# EAGLE design binaryspacebadgev1 (EAGLE 7.3.0)
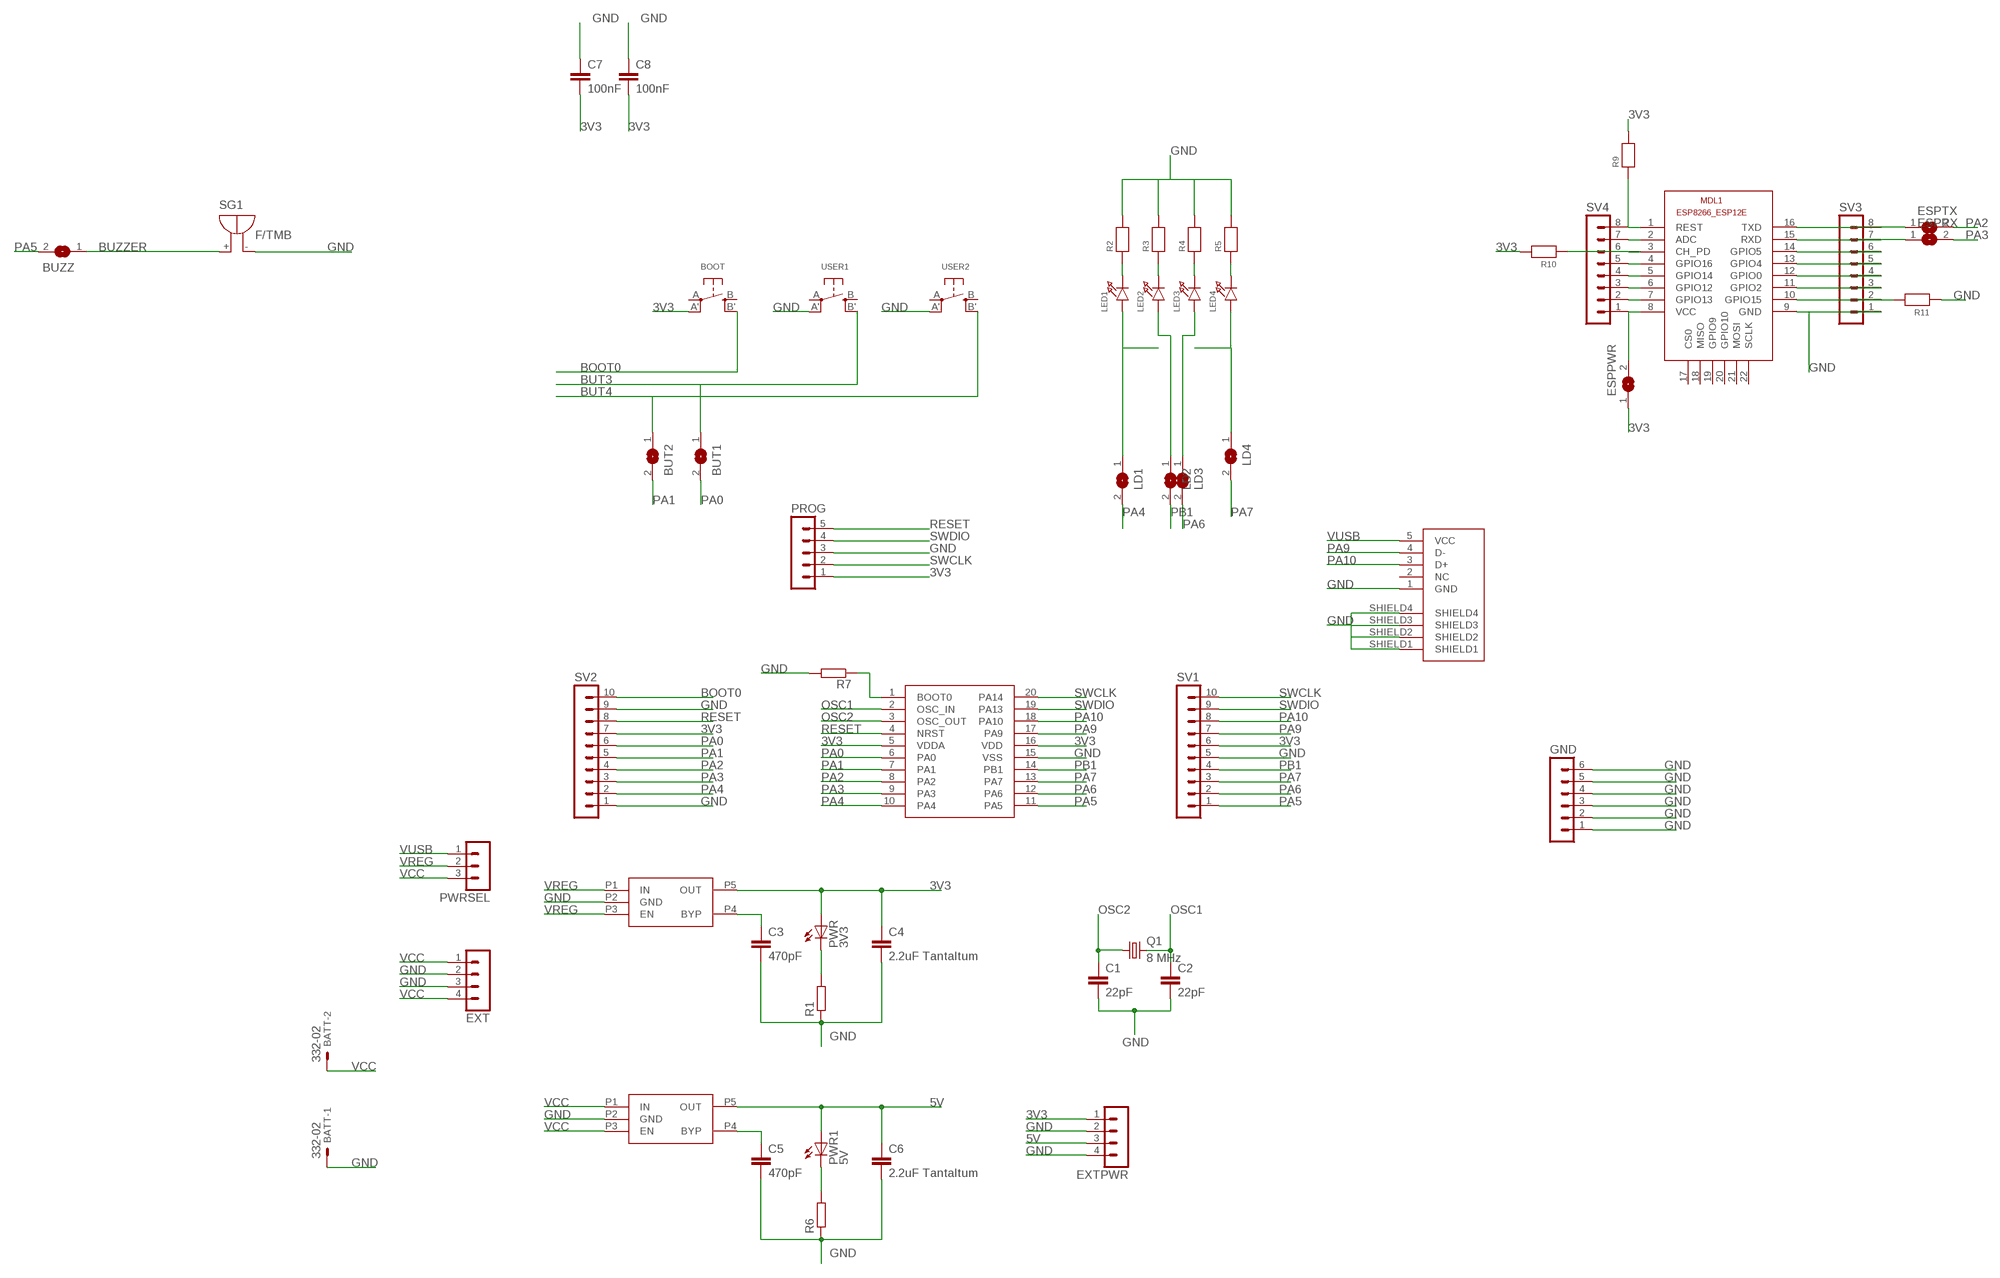
[diagram p0: schematic, sheet 1]

## Parts
BATT  332-02  [332-02]
BOOT  SWITCH_TACT_SMT  [EVQ-Q2]
BUT1  SOLDERJUMPER  [SOLDERJUMPER_ARROW_NOPASTE]
BUT2  SOLDERJUMPER  [SOLDERJUMPER_ARROW_NOPASTE]
BUZZ  SOLDERJUMPER  [SOLDERJUMPER_ARROW_NOPASTE]
C1  22pF  C-EUC0603  [C0603]
C2  22pF  C-EUC0603  [C0603]
C3  470pF  C-EUC0603  [C0603]
C4  2.2uF Tantaltum  C-EUC0805  [C0805]
C5  470pF  C-EUC0603  [C0603]
C6  2.2uF Tantaltum  C-EUC0805  [C0805]
C7  100nF  C-EUC0603  [C0603]
C8  100nF  C-EUC0603  [C0603]
ESPPWR  SOLDERJUMPER  [SOLDERJUMPER_ARROW_NOPASTE]
ESPRX  SOLDERJUMPER  [SOLDERJUMPER_ARROW_NOPASTE]
ESPTX  SOLDERJUMPER  [SOLDERJUMPER_ARROW_NOPASTE]
EXT  MA04-1  [MA04-1]
EXTPWR  MA04-1  [MA04-1]
GND  MA06-1  [MA06-1]
LD1  SOLDERJUMPER  [SOLDERJUMPER_ARROW_NOPASTE]
LD2  SOLDERJUMPER  [SOLDERJUMPER_ARROW_NOPASTE]
LD3  SOLDERJUMPER  [SOLDERJUMPER_ARROW_NOPASTE]
LD4  SOLDERJUMPER  [SOLDERJUMPER_ARROW_NOPASTE]
LED1  LED0805  [CHIPLED_0805]
LED2  LED0805  [CHIPLED_0805]
LED3  LED0805  [CHIPLED_0805]
LED4  LED0805  [CHIPLED_0805]
MDL1  ESP8266-12EESP8266-ESP12E  [ESP8266-ESP12E]
PROG  MA05-1  [MA05-1]
PWR  3V3  LEDSML0603  [SML0603]
PWR1  5V  LEDSML0603  [SML0603]
PWRSEL  MA03-1  [MA03-1]
Q1  8 MHz  CRYSTAL  [SM49]
R1  R-EU_R0603  [R0603]
R2  RESISTOR0603  [0603]
R3  RESISTOR0603  [0603]
R4  RESISTOR0603  [0603]
R5  RESISTOR0603  [0603]
R6  R-EU_R0603  [R0603]
R7  R-EU_R0603  [R0603]
R9  RESISTOR0603  [0603]
R10  RESISTOR0603  [0603]
R11  RESISTOR0603  [0603]
SG1  F/TMB  [F/TMB]
SV1  MA10-1  [MA10-1]
SV2  MA10-1  [MA10-1]
SV3  MA08-1  [MA08-1]
SV4  MA08-1  [MA08-1]
U$1  STM32F030X4792-5925  [TSSOP20]
U$2  MIC5219-X.XBM5MIC5219-3.3YM5TR  [SOT-23-5]
U$3  USBSOCK_MINI_SMD  [USBSOCK_MINI_SMD]
U$4  MIC5219-X.XBM5MIC5219-3.3YM5TR  [SOT-23-5]
USER1  SWITCH_TACT_SMT  [EVQ-Q2]
USER2  SWITCH_TACT_SMT  [EVQ-Q2]

## Nets
3V3: BOOT.A'(P1) C4.1 C7.2 C8.2 ESPPWR.1 EXTPWR.1 PROG.1 PWR.A R9.2 R10.2 SV1.6 SV2.7 U$1.5(VDDA) U$1.16(VDD) U$2.P5(OUT)
5V: C6.1 EXTPWR.3 PWR1.A U$4.P5(OUT)
BLAH: PWR1.C R6.2
BLAH2: PWR.C R1.2
BOOT0: BOOT.B'(S1) R7.1 SV2.10 U$1.1(BOOT0)
BUT3: BUT1.1 USER1.B'(S1)
BUT4: BUT2.1 USER2.B'(S1)
BUZZER: BUZZ.1 SG1.+
GND: BATT.1 C1.2 C2.2 C3.2 C4.2 C5.2 C6.2 C7.1 C8.1 EXT.2 EXT.3 EXTPWR.2 EXTPWR.4 GND.1 GND.2 GND.3 GND.4 GND.5 GND.6 MDL1.9(GND) PROG.3 R1.1 R2.2 R3.2 R4.2 R5.2 R6.1 R7.2 R11.1 SG1.- SV1.5 SV2.1 SV2.9 SV3.1 U$1.15(VSS) U$2.P2(GND) U$3.1(GND) U$3.SHIELD1 U$3.SHIELD2 U$3.SHIELD3 U$3.SHIELD4 U$4.P2(GND) USER1.A'(P1) USER2.A'(P1)
LED1: LD1.1 LED1.A
LED2: LD2.1 LED2.A
LED3: LD3.1 LED3.A
LED4: LD4.1 LED4.A
N$2: C3.1 U$2.P4(BYP)
N$3: C5.1 U$4.P4(BYP)
N$4: LED1.C R2.1
N$5: LED2.C R3.1
N$6: LED3.C R4.1
N$7: LED4.C R5.1
N$8: ESPTX.1 MDL1.16(TXD) SV3.8
N$9: ESPRX.1 MDL1.15(RXD) SV3.7
N$10: MDL1.14(GPIO5) SV3.6
N$11: MDL1.13(GPIO4) SV3.5
N$12: MDL1.12(GPIO0) SV3.4
N$13: MDL1.11(GPIO2) SV3.3
N$14: MDL1.10(GPIO15) R11.2 SV3.2
N$16: MDL1.1(REST) R9.1 SV4.8
N$17: MDL1.2(ADC) SV4.7
N$18: MDL1.3(CH_PD) R10.1 SV4.6
N$19: MDL1.4(GPIO16) SV4.5
N$20: MDL1.5(GPIO14) SV4.4
N$21: MDL1.6(GPIO12) SV4.3
N$22: MDL1.7(GPIO13) SV4.2
N$23: ESPPWR.2 MDL1.8(VCC) SV4.1
OSC1: C2.1 Q1.2 U$1.2(OSC_IN)
OSC2: C1.1 Q1.1 U$1.3(OSC_OUT)
PA0: BUT1.2 SV2.6 U$1.6(PA0)
PA1: BUT2.2 SV2.5 U$1.7(PA1)
PA2: ESPTX.2 SV2.4 U$1.8(PA2)
PA3: ESPRX.2 SV2.3 U$1.9(PA3)
PA4: LD1.2 SV2.2 U$1.10(PA4)
PA5: BUZZ.2 SV1.1 U$1.11(PA5)
PA6: LD3.2 SV1.2 U$1.12(PA6)
PA7: LD4.2 SV1.3 U$1.13(PA7)
PA9: SV1.7 U$1.17(PA9) U$3.4(D-)
PA10: SV1.8 U$1.18(PA10) U$3.3(D+)
PB1: LD2.2 SV1.4 U$1.14(PB1)
RESET: PROG.5 SV2.8 U$1.4(NRST)
SWCLK: PROG.2 SV1.10 U$1.20(PA14)
SWDIO: PROG.4 SV1.9 U$1.19(PA13)
VCC: BATT.2 EXT.1 EXT.4 PWRSEL.3 U$4.P1(IN) U$4.P3(EN)
VREG: PWRSEL.2 U$2.P1(IN) U$2.P3(EN)
VUSB: PWRSEL.1 U$3.5(VCC)
Unconnected: BOOT.A(P) BOOT.B(S) MDL1.17(CS0) MDL1.18(MISO) MDL1.19(GPIO9) MDL1.20(GPIO10) MDL1.21(MOSI) MDL1.22(SCLK) U$3.2(NC) USER1.A(P) USER1.B(S) USER2.A(P) USER2.B(S)

## Library data of the parts
BATT = con-garry:332-02: 2 Pin - 2mm Dual Row Source: www.mpe-connector.de / garry_shortform_2012.pdf
BOOT USER1 USER2 = microbuilder:SWITCH_TACT_SMT: SMT Tact Switches 6x6mm - Digikey: P12940SCT-ND KMR2 (4.6x2.8mm) - Digikey: 401-1426-1-ND EVQ-PQHB55 - Light Touch, 160GF (4.5x4.5mm) - Digikey: P8090SCT-ND
BUT1 BUT2 BUZZ ESPPWR ESPRX ESPTX LD1-LD4 = microbuilder:SOLDERJUMPER: SMD Solder JUMPER Solder the two pads together to create a connection, or remove the solder to break it. REFLOW - Use this footprint for solder paste and reflow ovens. WAVE - Use this footprint for hand-soldering (larger pads). CLOSED - Has a trace between the two pads to ensure it is closed by default. The trace needs to be cut to disable the jumper, and can be closed again by creating a solder bridge between the two pads.; BOM: EXCLUDE
C1-C8 = rcl:C-EU: CAPACITOR, European symbol
EXT EXTPWR = con-lstb:MA04-1: PIN HEADER; OC_FARNELL: unknown; OC_NEWARK: unknown
GND = con-lstb:MA06-1: PIN HEADER; OC_FARNELL: unknown; OC_NEWARK: unknown
LED1-LED4 = microbuilder:LED: LED
MDL1 = ESP8266-ESP12E:ESP8266-12E: ESP8266-12E with additional I/O and GPIO04/05 corrected The author cannot warrant that this library is free from error or will meet your specific requirements. Created by PuceBaboon.com. Komagane, Nagano, JAPAN
PROG = con-lstb:MA05-1: PIN HEADER; OC_FARNELL: unknown; OC_NEWARK: unknown
PWR PWR1 = led:LED: LED
PWRSEL = con-lstb:MA03-1: PIN HEADER; OC_FARNELL: unknown; OC_NEWARK: unknown
Q1 = protofactory:CRYSTAL: CRYSTAL
R1 R6 R7 = resistor:R-EU_: RESISTOR, European symbol
R2-R5 R9-R11 = microbuilder:RESISTOR: Resistors 0402 - 0402 Surface Mount Package 22 Ohm 1% 1/16W [Digikey: 311-22.0LRTR-ND] 33 Ohm 5% 1/16W 1.0K 5% 1/16W 1.5K 5% 1/16W 2.0K 1% 1/16W 10.0K 1% 1/16W [Digikey: 311-10.0KLRTR-ND] 10.0K 5% 1/16W [Digikey: RMCF0402JT10K0TR-ND] 12.1K 1% 1/16W [Digikey: 311-22.0LRTR-ND] 100.0K 5% 1/16W 0603 - 0603 Surface Mount Package 0 Ohm 1/10 Watt 1% Resistor 15 Ohm 1/10 Watt 1% Resistor 33 Ohm 1/10 Watt 1% Resistor 49.9 Ohm 1/10 Watt 1% Resistor 100 Ohm 1/10 Watt 1% Resistor 150 Ohm 1/10 Watt 1% Resistor 240 Ohm 1/10 Watt 1% Resistor 390 Ohm 1/10 Watt 1% Resistor 560 Ohm 1/10 Watt 1% Resistor 680 Ohm 1/10 Watt 1% Resistor 750 Ohm 1/10 Watt 1% Resistor 1.0K Ohm 1/10 Watt 1% Resistor 1.5K Ohm 1/10 Watt 1% Resistor 2.0K Ohm 1/10 Watt 1% Resistor 2.2K Ohm 1/10 Watt 1% Resistor 3.3K Ohm 1/10 Watt 1% Resistor 4.7K Ohm 1/10 Watt 1% Resistor 10.0K Ohm 1/10 Watt 1% Resistor 12.0K Ohm 1/10 Watt 1% Resistor 12.1K Ohm 1/10 Watt 1% Resistor 20.0K Ohm 1/10 Watt 1% Resistor 33.0K Ohm 1/10 Watt 1% Resistor 100.0K Ohm 1/10 Watt 1% Resistor 0805 - 0805 Surface Mount Package 0 Ohm 1/8 Watt 1% Resistor 33 Ohm 1/8 Watt 1% Resistor 100 Ohm 1/8 Watt 1% Resistor 150 Ohm 1/8 Watt 1% Resistor 200 Ohm 1/8 Watt 1% Resistor 240 Ohm 1/8 Watt 1% Resistor 330 Ohm 1/8 Watt 1% Resistor 390 Ohm 1/8 Watt 1% Resistor 470 Ohm 1/8 Watt 1% Resistor 1.0K Ohm 1/8 Watt 1% Resistor 1.5K Ohm 1/8 Watt 1% Resistor 2.0K Ohm 1/8 Watt 1% Resistor 4.7K Ohm 1/8 Watt 1% Resistor 5.1K Ohm 1/8 Watt 1% Resistor 5.6K Ohm 1/8 Watt 1% Resistor 10.0K Ohm 1/8 Watt 1% Resistor 22.0K Ohm 1/8 Watt 1% Resistor 33.0K Ohm 1/8 Watt 1% Resistor 100K Ohm 1/8 Watt 1% Resistor 1206 - 1206 Surface Mount Package 2012 - 2010 Surface Mount Package 0.11 Ohm 1/2 Watt 1% Resistor - Digikey: RHM.11UCT-ND
SG1 = buzzer:F/TMB: BUZZER Source: Buerklin; OC_FARNELL: unknown; OC_NEWARK: unknown
SV1 SV2 = con-lstb:MA10-1: PIN HEADER; OC_FARNELL: unknown; OC_NEWARK: unknown
SV3 SV4 = con-lstb:MA08-1: PIN HEADER; OC_FARNELL: unknown; OC_NEWARK: unknown
U$1 = protofactory:STM32F030X4
U$2 U$4 = protofactory:MIC5219-X.XBM5: 3.3V LDO
U$3 = protofactory:USBSOCK_MINI_SMD

## Board
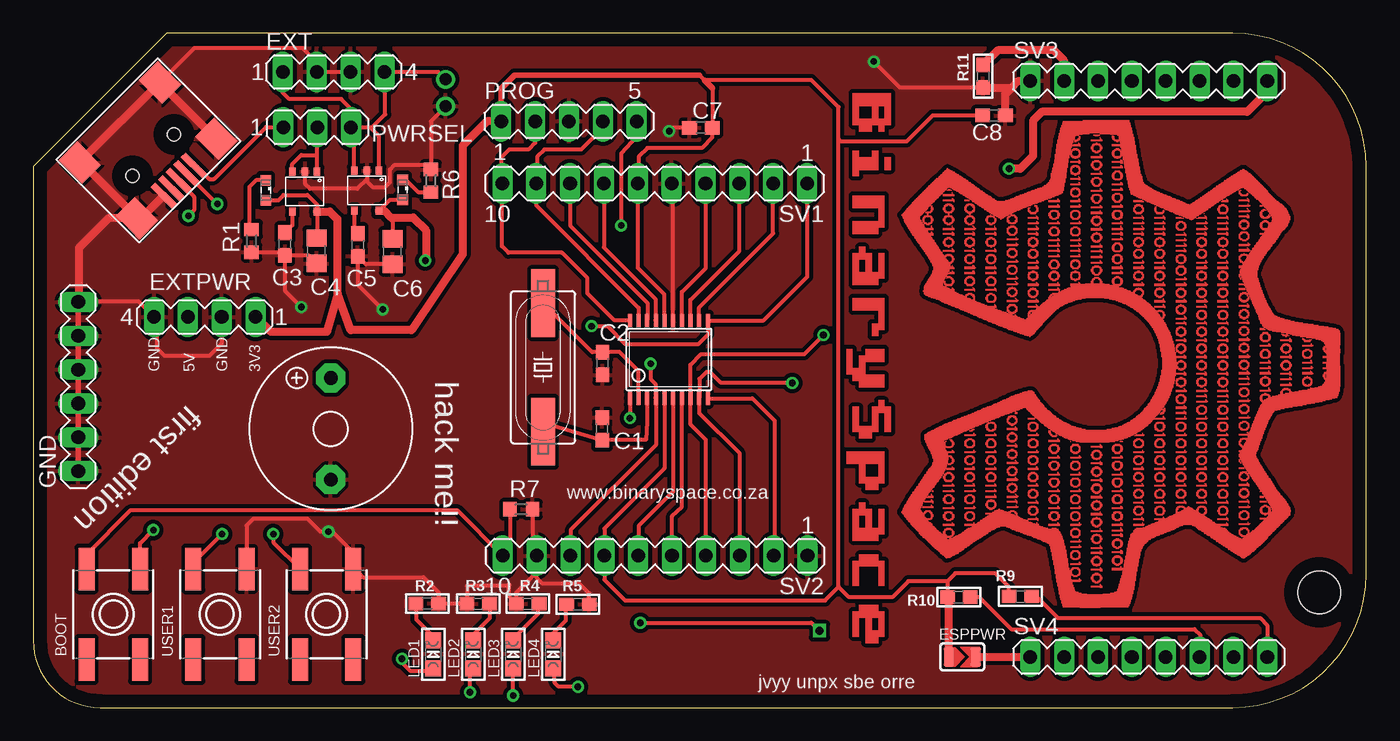
[diagram p1: board, top side]
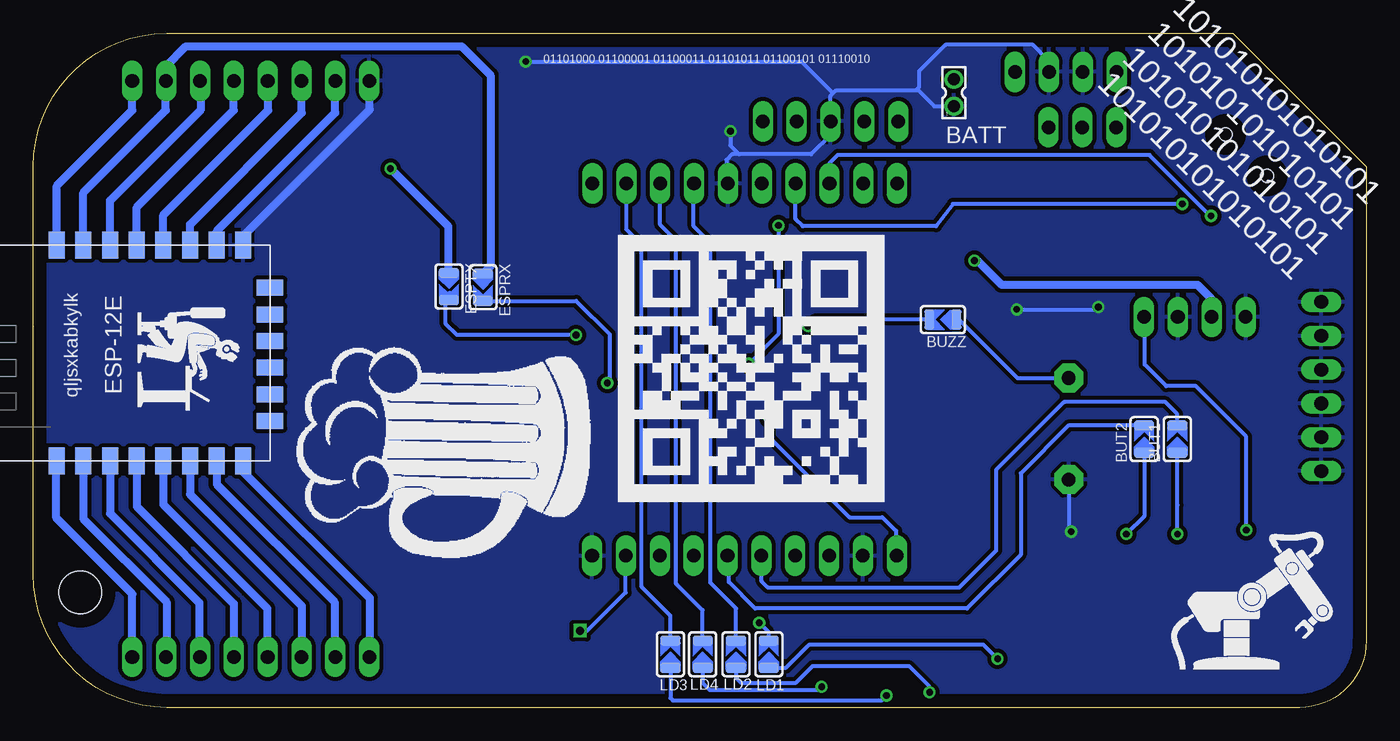
[diagram p2: board, bottom side, seen from below]

Size 100 x 50.6 mm. Coordinates in mm from the lower left corner, seen from the top.
Outline: 0,40.6 0,5 arc90 5,0 90,0 arc90 100,10 100,40.6 arc90 90,50.6 10,50.6 0,40.6
Copper layers (1*16): Top 0.035mm / dielectric 1.5mm / Bottom 0.035mm
Design rules "default": minimum track width 10mil, minimum drill 24mil, track to track 8mil, track to pad 8mil, pad to pad 8mil, via to via 8mil, smd to smd 8mil, copper to edge 40mil, drill to drill 8mil, minimum pad ring 10mil, minimum via ring 8mil, stop-mask expansion 4mil, vias tented up to drill 0mil, thermal gap 10mil
Holes 3.2 mm at 96.48,8.64

### Footprints (pad centres in the part's own frame; a part is rotated, then mirrored left to right if it is on the bottom)
332-02 = drill 0.9 pad 1.27: 1 0,-1; 2 0,1
EVQ-Q2 = smd 3.2 x 1.2: A -3.4,-2; A' 3.4,-2; B -3.4,2; B' 3.4,2
SOLDERJUMPER_ARROW_NOPASTE = smd 0.762 x 1.524: 1 -1.016,0; 2 1.016,0
C0603 = smd 1.1 x 1: 1 -0.85,0; 2 0.85,0
C0805 = smd 1.3 x 1.5: 1 -0.95,0; 2 0.95,0
MA04-1 = drill 1.016 long: 1 -3.81,0; 2 -1.27,0; 3 1.27,0; 4 3.81,0
MA06-1 = drill 1.016 long: 1 -6.35,0; 2 -3.81,0; 3 -1.27,0; 4 1.27,0; 5 3.81,0; 6 6.35,0
CHIPLED_0805 = smd 1.2 x 1.2: A 0,-1.05; C 0,1.05
ESP8266-ESP12E = smd 2 x 1.2: 1 0,16; 2 0,14; 3 0,12; 4 0,10; 5 0,8; 6 0,6; 7 0,4; 8 0,2; 9 16.2,2; 10 16.2,4; 11 16.2,6; 12 16.2,8; 13 16.2,10; 14 16.2,12; 15 16.2,14; 16 16.2,16 | smd 1.2 x 2: 17 11,0; 18 3,0; 19 5,0; 20 13,0; 21 7,0; 22 9,0
MA05-1 = drill 1.016 long: 1 -5.08,0; 2 -2.54,0; 3 0,0; 4 2.54,0; 5 5.08,0
SML0603 = smd 0.8 x 0.8: A 0.75,0; C -0.75,0
MA03-1 = drill 1.016 long: 1 -2.54,0; 2 0,0; 3 2.54,0
SM49 = smd 5.08 x 1.778: 1 -4.826,0; 2 4.826,0
R0603 = smd 1 x 1.1: 1 -0.85,0; 2 0.85,0
0603 = smd 1.1 x 1: 1 -0.85,0; 2 0.85,0
F/TMB = drill 1.016 pad 2.159 octagon: + 3.81,0; - -3.81,0
MA10-1 = drill 1.016 long: 1 -11.43,0; 2 -8.89,0; 3 -6.35,0; 4 -3.81,0; 5 -1.27,0; 6 1.27,0; 7 3.81,0; 8 6.35,0; 9 8.89,0; 10 11.43,0
MA08-1 = drill 1.016 long: 1 -8.89,0; 2 -6.35,0; 3 -3.81,0; 4 -1.27,0; 5 1.27,0; 6 3.81,0; 7 6.35,0; 8 8.89,0
TSSOP20 = smd 0.305 x 0.991: 1 -2.925,-2.918; 2 -2.275,-2.918; 3 -1.625,-2.918; 4 -0.975,-2.918; 5 -0.325,-2.918; 6 0.325,-2.918; 7 0.975,-2.918; 8 1.625,-2.918; 9 2.275,-2.918; 10 2.925,-2.918; 11 2.925,2.918; 12 2.275,2.918; 13 1.625,2.918; 14 0.975,2.918; 15 0.325,2.918; 16 -0.325,2.918; 17 -0.975,2.918; 18 -1.625,2.918; 19 -2.275,2.918; 20 -2.925,2.918
SOT-23-5 = smd 0.5 x 0.6: P1 0.2,0.25; P2 1.1,0.25; P3 2.05,0.25; P4 2.05,3.25; P5 0.2,3.25
USBSOCK_MINI_SMD = smd 0.5 x 2.25: 1 1.6,1.6; 2 0.8,1.6; 3 0,1.6; 4 -0.8,1.6; 5 -1.6,1.6 | smd 2 x 2.5: SHIELD1 -4.2,1.4; SHIELD2 4.2,1.4; SHIELD3 -4.2,-4.6; SHIELD4 4.3,-4.6 | hole 1: 2.2,-1.1; -2.2,-1.1

### Placement (x,y rotation side)
BATT  30.93,46.14 0 bottom
BOOT  6,7 90 top
BUT1  14.17,20.14 90 bottom
BUT2  16.66,20.14 90 bottom
BUZZ  31.76,29.11 180 bottom
C1  42.68,20.91 90 top
C2  42.7,25.82 270 top
C3  18.88,34.79 270 top
C4  21.25,34.28 270 top
C5  24.34,34.72 270 top
C6  26.95,34.22 270 top
C7  50.08,43.51 0 top
C8  72.08,44.43 180 top
ESPPWR  69.7,3.8 0 top
ESPRX  66.27,31.54 270 bottom
ESPTX  68.82,31.6 270 bottom
EXT  22.53,47.7 0 top
EXTPWR  12.86,29.31 180 top
GND  3.37,24.09 90 top
LD1  44.82,4 90 bottom
LD2  47.28,4 90 bottom
LD3  52.2,4 90 bottom
LD4  49.78,4 90 bottom
LED1  30,4 0 top
LED2  33,4 0 top
LED3  36,4 0 top
LED4  39,4 0 top
MDL1  82.24,18.51 90 bottom
PROG  40.19,43.99 0 top
PWR  17.44,38.82 270 top
PWR1  27.7,38.84 270 top
PWRSEL  21.3,43.55 0 top
Q1  38.24,25.53 90 top
R1  16.37,35.02 90 top
R2  29.55,7.81 0 top
R3  33.38,7.79 180 top
R4  37.09,7.79 180 top
R5  40.86,7.75 0 top
R6  29.83,39.53 270 top
R7  36.6,14.88 0 top
R9  74.06,8.34 180 top
R10  69.44,8.3 180 top
R11  71.26,47.38 90 top
SG1  22.31,20.92 90 top
SV1  46.62,39.33 180 top
SV2  46.65,11.39 180 top
SV3  83.69,47.03 0 top
SV4  83.69,3.8 0 top
U$1  47.68,26.13 0 top
U$2  21.48,40.47 180 top
U$3  9.77,40.69 225 top
U$4  26.13,40.53 180 top
USER1  14,7 90 top
USER2  22,7 90 top

### Tracks (layer width: path | path; a pad name or v marks a point on that pad's centre or on a via)
3V3  (via drill 0.5)
  Top 0.305: U$1.16 47.35,31 45.36,33 SV1.6 45.42,39.4 45.42,41.34 46.08,42 50.16,42 50.93,42.77 C7.2 50.94,46.5 | 47.34,17.94 47.35,17.95 U$1.5 47.34,17.94 | R9.2 73.21,9.05 72.18,10.08 69.18,10.08 68.58,9.48 | 68.58,9.48 R10.2 | 49.98,47.46 50.37,47.07 50.4,47.1 58.38,47.1 60.42,45.06 60.42,42.66 | 68.58,9.48 65.64,9.48 64.44,8.28 61.2,8.28 60.42,9.06 | 60.42,9.06 60.42,42.66 | BOOT.A' 8,12.32 v9,13.32 | C8.2 67.47,44.43 65.52,42.48 60.6,42.48 60.42,42.66 | C4.1 21.28,35.26 U$2.P5 21.3,37.24 21.3,37.74 20.58,38.46 18.78,38.46 18.39,38.07 PWR.A | 47.34,17.94 42.84,13.44 SV2.7 42.84,9.6 44.4,8.04 59.4,8.04 60.42,9.06
  Top 0.406: PROG.1 35.11,46.45 36.12,47.46 49.98,47.46 | 50.37,47.07 50.94,46.5
  Top 0.61: ESPPWR.1 68.68,8.21 R10.2 | U$2.P5 22.24,37.22 22.8,36.66 22.8,31.26 22.83,31.05 | 22.83,31.05 22.02,28.2 17.84,28.2 EXTPWR.1 | PROG.1 34.03,43.99 32.22,42.18 32.22,34.02 28.38,28.32 23.82,28.32 22.83,31.05
  Bottom 0.305: v9,13.32 9,20.34 12.78,24.12 15,24.12 16.62,25.74 16.62,29.26 EXTPWR.1
5V  (via drill 0.5)
  Top 0.305: C6.1 26.94,36.48 26.14,37.28 U$4.P5 26.74,38.09 PWR1.A
  Top 0.61: U$4.P5 26.32,37.28 26.82,36.78 28.5,36.78 29.46,35.82 29.46,33.6 v29.4,33.54
  Bottom 0.61: v29.4,33.54 29.16,33.54 27.36,31.74 12.66,31.74 11.64,30.72 11.64,29.36 EXTPWR.3
BLAH
  Top 0.305: PWR1.C 27.97,39.59 28.86,38.7 29.81,38.7 R6.2
BLAH2
  Top 0.305: PWR.C 16.71,39.57 16.2,39.06 16.2,36.04 R1.2
BOOT0  (via drill 0.5)
  Top 0.305: U$1.1 v44.76,21.73 v44.76,21.72 | R7.1 35.75,11.92 SV2.10 31.79,14.82 7.32,14.82 4,11.5 BOOT.B'
  Bottom 0.305: v44.76,21.72 44.76,20.28 38.76,14.28 36.3,14.28 35.28,13.26 35.28,11.45 SV2.10
BUT3  (via drill 0.5)
  Top 0.305: USER1.B' 12,10.86 v14.16,13.02
  Bottom 0.305: v14.16,13.02 14.16,15.17 BUT1.1
BUT4  (via drill 0.5)
  Top 0.305: v18,13.02 18,12.4 USER2.B'
  Bottom 0.305: BUT2.1 16.66,14.36 v18,13.02
BUZZER
  Bottom 0.305: BUZZ.1 30.55,29.11 26.16,24.72 SG1.+
GND  (via drill 0.5)
  Top 0.305: U$1.15 48.01,39.22 SV1.5 | R7.2 37.45,11.7 SV2.9 37.74,11.37 37.74,10.14 37.56,9.96 | U$3.1 9.62,38.42 7.86,36.66 7.86,36.78 3.72,40.92 | C7.1 47.95,43.51 v47.7,43.26 | 37.56,9.96 36.24,8.64 R4.2 35.7,8.33 35.7,9.24 35.58,9.12 32.52,9.12 32.53,9.11 R3.2 32.51,7.81 R2.2 30.4,8.66 29.28,9.78 24.74,9.78 24.06,10.46 | R5.2 41.71,8.57 40.98,9.3 38.22,9.3 37.56,9.96 | 3.42,30.49 7.87,30.49 EXTPWR.4 9.3,29.06 9.3,26.94 9.84,26.4 13.2,26.4 14.13,27.33 EXTPWR.2 | 24.06,10.46 24.06,11.58 22.44,13.2 v22.14,13.2 21.54,13.2 20.58,14.16 16.5,14.16 16,13.66 USER1.A' | 24.06,10.46 USER2.A' | R11.1 65.01,46.53 v63.06,48.48 | EXT.3 EXT.2 21.26,48.46 20.22,49.5 12.08,49.5 U$3.SHIELD3 | U$2.P2 20.4,40.2 20.4,39.3 20.76,38.94 24.3,38.94 25.03,39.67 U$4.P2 25.03,39.47 25.44,39.06 26.4,39.06 26.76,39.42 26.76,40.38 27.12,40.74 29.47,40.74 R6.1 29.83,44 v30.95,45.12 | R1.1 18.65,34.17 C3.2 | C3.2 20.64,33.94 C4.2 | C6.2 24.94,33.27 C5.2 24.34,31.76 v26.22,29.88 | v20.1,30.06 18.9,31.26 18.9,32.58 18.88,32.6 C3.2
  Top 0.406: GND.6 GND.5 GND.4 GND.3 GND.2 GND.1
  Top 0.61: U$3.SHIELD1 U$3.SHIELD3 3.72,41.14 3.72,40.92 | U$3.SHIELD4 3.62,40.9 U$3.SHIELD2 | U$3.SHIELD2 8.08,36.73 U$3.1 | U$3.SHIELD2 5.65,36.73 3.42,34.5 3.42,30.49 GND.6 | C8.1 72.93,46.05 73.41,46.53 | SV3.1 73.92,47.04 73.41,46.53 | R11.1 73.41,46.53
  Bottom 0.305: 47.04,41.52 41.64,41.52 40.19,42.97 PROG.3 40.19,45.91 39.99,46.11 | 47.04,41.52 47.58,41.52 48,41.1 48,39.44 SV1.5 | v47.7,43.26 47.7,42.18 47.04,41.52 | 39.99,46.11 39.78,46.32 33.78,46.32 | 33.78,46.32 33.6,46.32 32.4,45.12 v30.95,45.12 BATT.1 | SG1.- 22.31,13.37 v22.14,13.2 | v63.06,48.48 42.36,48.48 39.99,46.11 | EXT.3 23.8,48.52 25.02,49.74 31.56,49.74 33.54,47.76 33.54,46.56 33.78,46.32 | v26.22,29.88 20.28,29.88 v20.1,30.06
  Bottom 0.61: MDL1.9 84.24,35.4 74.76,44.88 74.76,46.99 SV3.1
  pour Top (isolate 0.305): -0.06,-0.12 100.08,-0.12 100.08,50.7 -0.12,50.7 -0.12,-0.18
  pour Bottom (isolate 0.305): -0.3,0.3 100.14,0.3 100.14,50.34 -0.6,50.34 -0.6,0.24
LED1  (via drill 0.5)
  Top 0.305: v27.66,3.66 27.66,3.36 28.26,2.76 29.81,2.76 LED1.A
  Bottom 0.305: LD1.1 43.52,2.98 41.76,4.74 28.74,4.74 v27.66,3.66
LED2  (via drill 0.5)
  Top 0.305: v32.76,1.14 32.76,2.71 LED2.A
  Bottom 0.305: LD2.1 47.28,2.22 46.92,1.86 42.78,1.86 41.52,3.12 34.32,3.12 32.82,1.62 32.82,1.2 v32.76,1.14
LED3  (via drill 0.5)
  Top 0.305: v36,0.9 LED3.A
  Bottom 0.305: LD3.1 52.2,0.72 52.02,0.54 36.36,0.54 v36,0.9
LED4  (via drill 0.5)
  Top 0.305: v40.86,1.56 39.42,1.56 39.12,1.86 39.12,2.83 LED4.A
  Bottom 0.305: LD4.1 49.78,1.84 49.26,1.32 41.1,1.32 v40.86,1.56
N$2
  Top 0.305: U$2.P4 19.43,36.19 C3.1
N$3
  Top 0.305: U$4.P4 24.08,35.83 C5.1
N$4
  Top 0.305: LED1.C 30,5.34 28.74,6.6 28.74,7.77 R2.1
N$5
  Top 0.305: LED2.C 33,5.46 34.26,6.72 34.26,7.76 R3.1
N$6
  Top 0.305: LED3.C 36,5.16 37.86,7.02 37.86,7.71 R4.1
N$7
  Top 0.305: LED4.C 39,5.58 39.96,6.54 39.96,7.7 R5.1
N$8  (via drill 0.5)
  Top 0.61: SV3.8 92.58,46.2 91.08,44.7 75.66,44.7 75,44.04 75,41.4 74.04,40.44 v73.2,40.44
  Bottom 0.61: MDL1.16 98.24,39.16 92.58,44.82 SV3.8 | v73.2,40.44 68.88,36.12 68.88,32.1 68.82,32.16 ESPTX.1
N$9
  Bottom 0.61: MDL1.15 96.24,38.64 90.06,44.82 90.06,47.01 SV3.7 90.04,48.14 88.56,49.62 67.86,49.62 65.7,47.46 65.7,33.13 ESPRX.1
N$10
  Bottom 0.61: MDL1.14 94.24,38.06 87.42,44.88 87.42,46.95 SV3.6
N$11
  Bottom 0.61: MDL1.13 92.24,37.54 84.96,44.82 SV3.5
N$12
  Bottom 0.61: MDL1.12 90.24,36.96 82.38,44.82 82.38,46.99 SV3.4
N$13
  Bottom 0.61: MDL1.11 88.24,36.26 79.86,44.64 79.86,47.01 SV3.3
N$14
  Top 0.61: SV3.2 77.34,48.54 76.56,49.32 72.35,49.32 R11.2
  Bottom 0.61: MDL1.10 86.24,35.74 77.34,44.64 SV3.2
N$16
  Top 0.305: R9.1 75.24,8.34 76.86,6.72 92.04,6.72 92.58,6.18 SV4.8
  Bottom 0.61: SV4.8 92.58,8.52 98.28,14.22 98.28,18.47 MDL1.1
N$17
  Bottom 0.61: MDL1.2 96.24,14.16 90,7.92 90,3.84 SV4.7
N$18
  Top 0.305: R10.1 70.96,8.3 73.38,5.88 87.12,5.88 87.54,5.46 87.54,3.84 SV4.6
  Bottom 0.61: MDL1.3 94.24,14.56 87.54,7.86 87.54,3.84 SV4.6
N$19
  Bottom 0.61: MDL1.4 92.24,15.08 84.96,7.8 SV4.5
N$20
  Bottom 0.61: MDL1.5 90.24,15.24 82.44,7.44 82.44,3.82 SV4.4
N$21
  Bottom 0.61: MDL1.6 88.24,16 79.86,7.62 79.86,3.82 SV4.3
N$22
  Bottom 0.61: MDL1.7 86.24,16.76 77.4,7.92 77.4,3.86 SV4.2
N$23
  Top 0.61: ESPPWR.2 SV4.1
  Bottom 0.61: MDL1.8 84.24,17.7 74.76,8.22 74.76,3.84 SV4.1
OSC1
  Top 0.305: U$1.2 45.41,25.27 43.98,26.7 42.73,26.7 C2.1 41.93,26.67 Q1.2
OSC2
  Top 0.305: U$1.3 46.05,21.45 45.96,20.1 42.88,20.1 C1.1 38.74,21.2 Q1.1
PA0
  Top 0.305: U$1.6 48.01,16.2 45.42,13.62 45.42,11.43 SV2.6
  Bottom 0.305: BUT1.2 14.17,22.03 15.06,22.92 22.68,22.92 27.78,17.82 27.78,11.76 30.54,9 44.88,9 45.36,9.48 45.36,11.37 SV2.6
PA1
  Top 0.305: SV2.5 47.92,14.38 48.66,15.06 48.66,23.16 U$1.7
  Bottom 0.305: BUT2.2 22.34,21.16 25.92,17.58 25.92,11.46 29.94,7.44 45.84,7.44 47.82,9.42 47.82,11.29 SV2.5
PA2  (via drill 0.5)
  Top 0.305: SV2.4 50.46,20.1 49.32,21.24 49.32,23.2 U$1.8 49.3,25.73 50.1,26.52 57.84,26.52 v59.28,27.96
  Bottom 0.305: v59.28,27.96 68.22,27.96 69.06,28.8 69.06,30.84 68.76,31.14 68.76,30.64 ESPTX.2
PA3  (via drill 0.5)
  Top 0.305: SV2.3 53,19.06 49.98,22.08 49.98,23.19 U$1.9 49.98,23.24 49.98,24.66 50.52,25.2 50.76,25.2 51.6,24.36 v56.94,24.36
  Bottom 0.305: ESPRX.2 59.26,30.52 56.76,28.02 56.76,24.54 v56.94,24.36
PA4  (via drill 0.5, 0.6)
  Top 0.305: U$1.10 53.95,23.21 55.62,21.54 55.62,11.47 SV2.2 55.5,11.35 | v45.54,6.36 58.38,6.36 v58.98,5.76
  Bottom 0.305: LD1.2 44.82,5.64 v45.54,6.36 | v58.98,5.76 58.44,5.76 55.56,8.64 55.56,11.37 SV2.2
PA5  (via drill 0.5)
  Top 0.305: SV1.1 58.08,39.3 58.08,32.34 54.79,29.05 U$1.11 50.64,29.01 50.64,28.02 49.92,27.3 44.4,27.3 43.08,28.62 v41.88,28.62
  Bottom 0.305: BUZZ.2 41.39,29.11 v41.88,28.62
PA6
  Top 0.305: U$1.12 49.95,30.04 55.5,35.58 SV1.2
  Bottom 0.305: LD3.2 52.2,6.9 54.36,9.06 54.36,34.74 55.5,35.88 SV1.2
PA7
  Top 0.305: U$1.13 49.3,30.59 52.98,34.26 SV1.3
  Bottom 0.305: LD4.2 49.78,7.3 51.78,9.3 51.78,35.04 52.98,36.24 SV1.3
PA9  (via drill 0.5)
  Top 0.305: SV1.7 42.81,34.53 46.68,30.66 46.68,29.07 U$1.17 | U$3.4 11.36,40.12 11.28,40.2 11.4,40.2 v13.8,37.8
  Bottom 0.305: v13.8,37.8 31.02,37.8 32.28,36.12 42.27,36.12 42.81,36.66 SV1.7
PA10  (via drill 0.5)
  Top 0.305: SV1.8 40.27,36.17 46.08,30.36 46.08,29.07 U$1.18 | U$3.3 10.9,39.46 10.86,39.42 10.98,39.42 12.06,38.34 12.06,37.32 v11.64,36.9
  Bottom 0.305: v11.64,36.9 11.7,36.9 16.26,41.46 39.66,41.46 40.26,40.86 SV1.8
PB1
  Top 0.305: U$1.14 48.66,31.2 50.46,33 50.46,39.3 SV1.4
  Bottom 0.305: LD2.2 47.28,7.44 49.2,9.36 49.2,34.86 50.46,36.12 50.46,39.3 SV1.4
RESET  (via drill 0.5)
  Top 0.305: SV2.8 40.32,11.41 40.32,13.32 46.7,19.7 U$1.4 46.68,23.24 46.68,24.3 46.32,24.66 v46.32,25.8 | PROG.5 45.27,44.19 45.24,44.22 45.24,42.84 44.1,41.58 v44.1,36.18
  Bottom 0.305: v44.1,36.18 44.1,28.02 v46.32,25.8
SWCLK
  Top 0.305: U$1.20 43.61,29.05 41.58,31.08 41.58,32.22 39.66,34.14 35.64,34.14 35.16,34.62 35.16,39.3 SV1.10 35.1,39.42 35.1,41.28 35.7,41.88 37.14,41.88 37.65,42.39 PROG.2
SWDIO
  Top 0.305: U$1.19 45.42,29.06 45.42,30 37.73,37.69 SV1.9 37.8,39.4 37.8,41.34 38.34,41.88 41.1,41.88 42.73,43.51 PROG.4
VCC
  Top 0.305: PWRSEL.3 25.26,43.55 | 25.26,43.55 25.43,43.55 26.4,44.52 EXT.4 30.37,47.7 BATT.2 | PWRSEL.3 23.84,44.92 23.1,45.66 19.2,45.66 18.72,46.14 EXT.1 | U$4.P3 24.08,43.31 PWRSEL.3 | U$4.P1 25.93,42.88 25.26,43.55
VREG
  Top 0.305: U$2.P1 21.28,41.52 | 21.28,41.52 21.28,43.53 PWRSEL.2 | U$2.P3 19.43,40.79 20.1,41.46 21.22,41.46 21.28,41.52
VUSB
  Top 0.305: U$3.5 12.18,40.69 13.2,39.66 13.56,39.66 17.46,43.56 PWRSEL.1
(copper drawn outside any net)
  shapes: Top area x7964

### Text on the board
tPlace: GND | 5V | GND | 3V3 | www.binaryspace.co.za | jvyy unpx sbe orre
tNames: hack me!! | first edition
bNames: 01101000 01100001 01100011 01101011 01100101 01110010 | 101010101010101 / 101010101010101 / 101010101010101 / 101010101010101 | qljsxkabkylk